# EAGLE design SensorBoard (EAGLE 6.5.0)
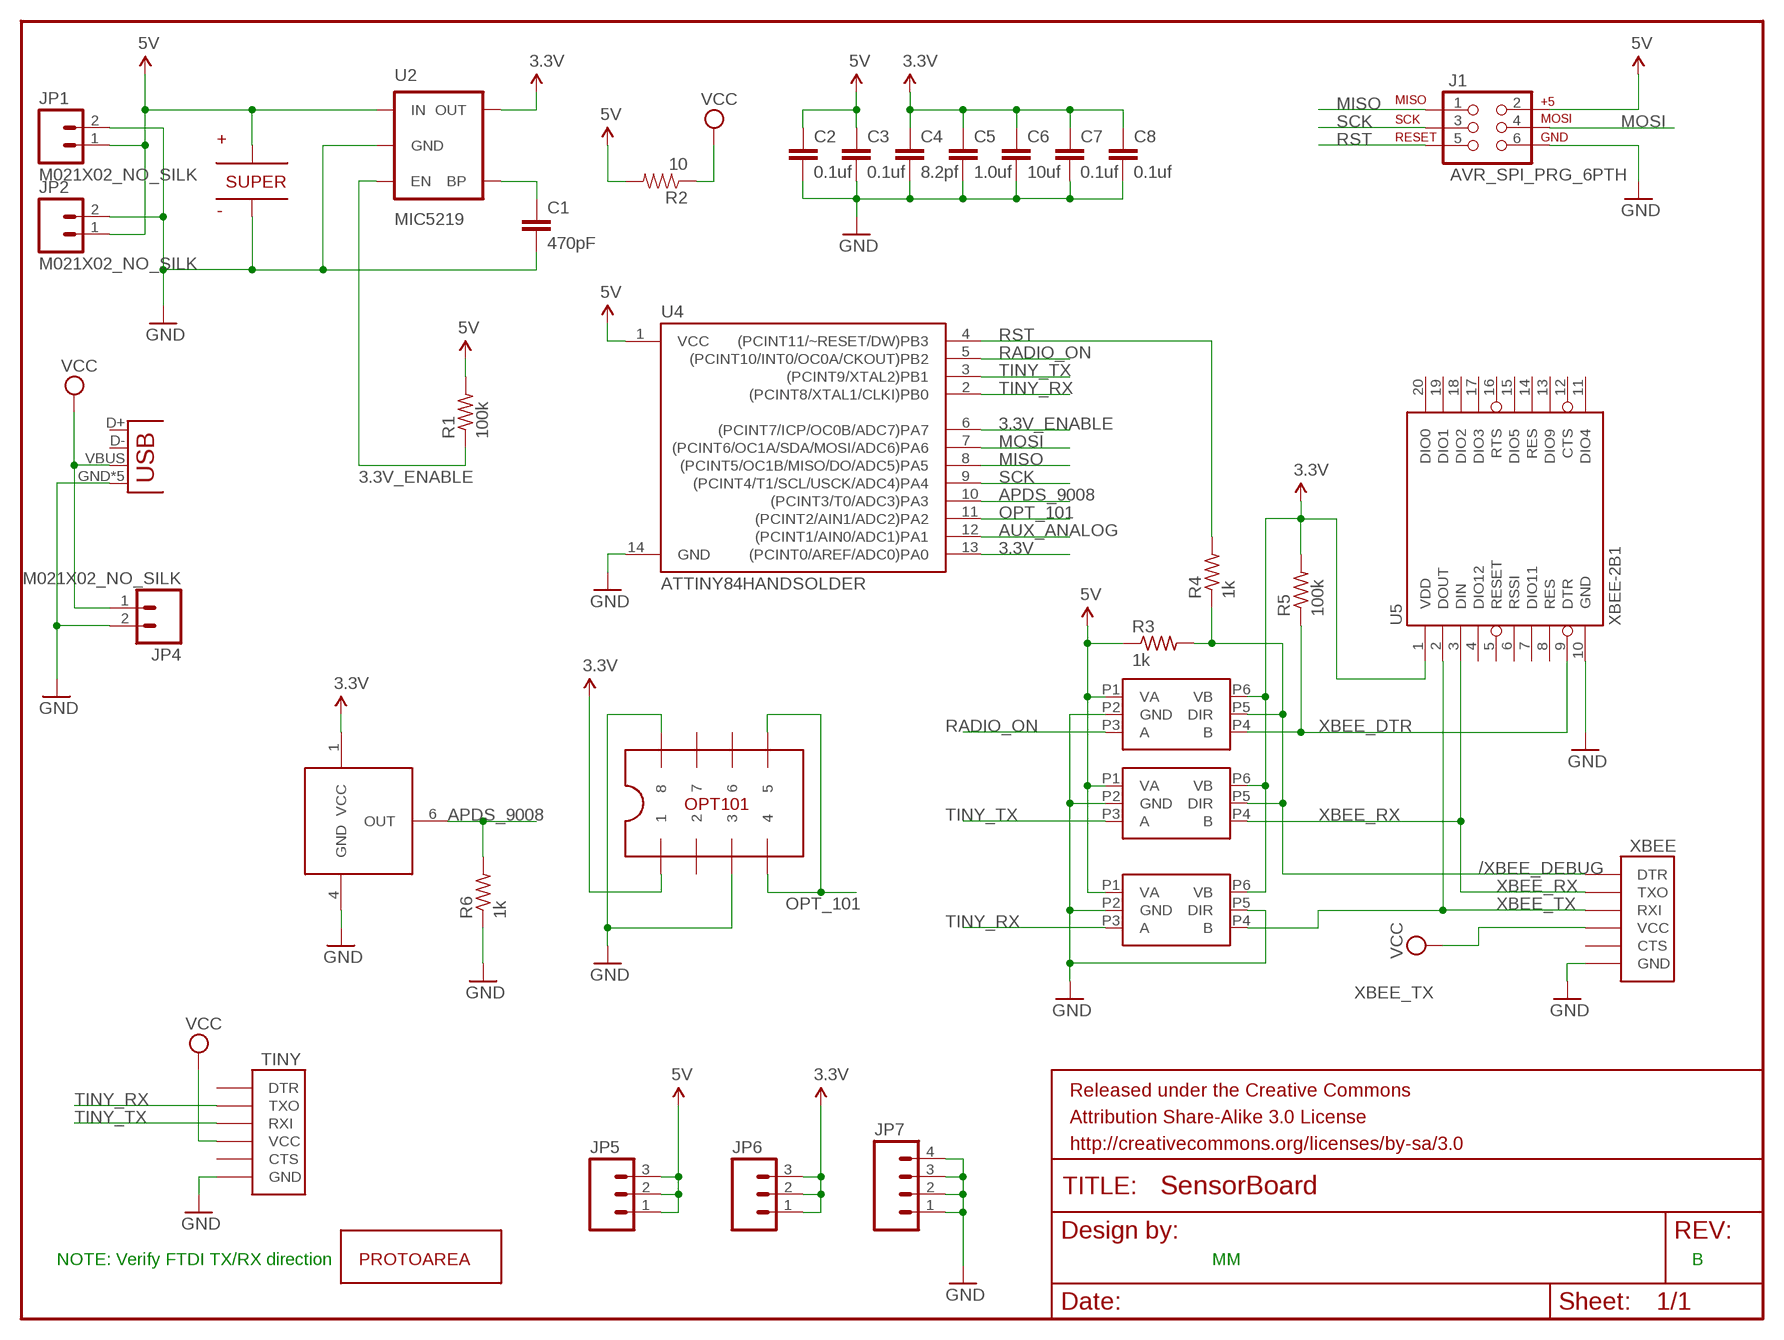
[diagram p0: schematic, sheet 1]

## Parts
C1  470pF  CAP1210  [1210]
C2  0.1uf  CAP1210  [1210]
C3  0.1uf  CAP1210  [1210]
C4  8.2pf  CAP1210  [1210]
C5  1.0uf  CAP1210  [1210]
C6  10uf  CAP1210  [1210]
C7  0.1uf  CAP1210  [1210]
C8  0.1uf  CAP1210  [1210]
FRAME1  FRAME-LETTER  [CREATIVE_COMMONS]
J1  AVR_SPI_PRG_6PTH  [2X3]
JP1  M021X02_NO_SILK  [1X02_NO_SILK]
JP2  M021X02_NO_SILK  [1X02_NO_SILK]
JP3  USBSMD  [USB-MINIB]
JP4  M021X02_NO_SILK  [1X02_NO_SILK]
JP5  M031X03_NO_SILK  [1X03_NO_SILK]
JP6  M031X03_NO_SILK  [1X03_NO_SILK]
JP7  M041X04_NO_SILK  [1X04_NO_SILK]
R1  100k  R-US_R1210  [R1210]
R2  10  RESISTORAXIAL-0.3  [AXIAL-0.3]
R3  1k  R-US_R1210  [R1210]
R4  1k  R-US_R1210  [R1210]
R5  100k  R-US_R1210  [R1210]
R6  1k  R-US_R1210  [R1210]
TINY  FTDI_DEVICE  [FTDI_DEVICE_SIDE]
U1  APDS-9008  [APDS-9008]
U2  MIC5219  V_REG_MIC52193.3V  [SOT23-5]
U3  OPT101TH  [DIL08]
U4  ATTINY84HANDSOLDER  [SO14-EZ]
U5  XBEE-2B1  [XBEE-1]
U$1  FYD0H225ZF  [SUPERCAP-28.5]
U$2  PROTOAREA-10X10  [PROTOAREA-10X10]
U$3  SN74LVC1T45  [DBV-R-PDSO-G6]
U$4  SN74LVC1T45  [DBV-R-PDSO-G6]
U$5  SN74LVC1T45  [DBV-R-PDSO-G6]
XBEE  FTDI_DEVICE  [FTDI_DEVICE_SIDE]

## Nets
3.3V [power]: C4.1 C5.1 C6.1 C7.1 C8.1 JP6.1 JP6.2 JP6.3 R5.2 U1.1(VCC) U2.5(OUT) U3.1 U4.13((PCINT0/AREF/ADC0)PA0) U5.1(VDD) U$3.P6(VB) U$4.P6(VB) U$5.P6(VB)
3.3V_ENABLE: R1.1 U2.3(EN) U4.6((PCINT7/ICP/OC0B/ADC7)PA7)
5V [power]: C2.1 C3.1 J1.2 JP1.1 JP2.1 JP5.1 JP5.2 JP5.3 R1.2 R2.P$2 R3.1 U2.1(IN) U4.1(VCC) U$1.+ U$3.P1(VA) U$4.P1(VA) U$5.P1(VA)
/XBEE_DEBUG: R3.2 R4.1 U$3.P5(DIR) U$4.P5(DIR) XBEE.P$1(DTR)
APDS_9008: R6.2 U1.6(OUT) U4.10((PCINT3/T0/ADC3)PA3)
AUX_ANALOG [power]: U4.12((PCINT1/AIN0/ADC1)PA1)
GND [power]: C1.2 C2.2 C3.2 C4.2 C5.2 C6.2 C7.2 C8.2 J1.6 JP1.2 JP2.2 JP3.GND JP3.MTN1(GND) JP3.MTN2(GND) JP3.MTN3(GND) JP3.MTN4(GND) JP4.2 JP7.1 JP7.2 JP7.3 JP7.4 R6.1 TINY.P$6(GND) U1.4(GND) U2.2(GND) U3.3 U3.8 U4.14(GND) U5.10(GND) U$1.- U$3.P2(GND) U$4.P2(GND) U$5.P2(GND) U$5.P5(DIR) XBEE.P$6(GND)
MISO: J1.1 U4.8((PCINT5/OC1B/MISO/DO/ADC5)PA5)
MOSI: J1.4 U4.7((PCINT6/OC1A/SDA/MOSI/ADC6)PA6)
N$3: C1.1 U2.4(BP)
OPT_101: U3.4 U3.5 U4.11((PCINT2/AIN1/ADC2)PA2)
RADIO_ON: U4.5((PCINT10/INT0/OC0A/CKOUT)PB2) U$3.P3(A)
RST: J1.5 R4.2 U4.4((PCINT11/~RESET/DW)PB3)
SCK: J1.3 U4.9((PCINT4/T1/SCL/USCK/ADC4)PA4)
TINY_RX: TINY.P$2(TXO) U4.2((PCINT8/XTAL1/CLKI)PB0) U$5.P3(A)
TINY_TX: TINY.P$3(RXI) U4.3((PCINT9/XTAL2)PB1) U$4.P3(A)
VCC: JP3.VBUS JP4.1 R2.P$1 TINY.P$4(VCC) XBEE.P$4(VCC)
XBEE_DTR: R5.1 U5.9(DTR) U$3.P4(B)
XBEE_RX: U5.3(DIN) U$4.P4(B) XBEE.P$2(TXO)
XBEE_TX: U5.2(DOUT) U$5.P4(B) XBEE.P$3(RXI)
Unconnected: JP3.D+ JP3.D- TINY.P$1(DTR) TINY.P$5(CTS) U3.2 U3.6 U3.7 U5.4(DIO12) U5.5(RESET) U5.6(RSSI) U5.7(DIO11) U5.8(RES) U5.11(DIO4) U5.12(CTS) U5.13(DIO9) U5.14(RES) U5.15(DIO5) U5.16(RTS) U5.17(DIO3) U5.18(DIO2) U5.19(DIO1) U5.20(DIO0) XBEE.P$5(CTS)

## Notes on the sheet
- NOTE: Verify FTDI TX/RX direction | MM | B

## Library data of the parts
C1-C8 = SparkFun-Capacitors:CAP: Capacitor Standard 0603 ceramic capacitor, and 0.1" leaded capacitor.
FRAME1 = MyLibrary:FRAME-LETTER: Schematic Frame Standard 8.5x11 US Letter frame
J1 = SparkFun-Connectors:AVR_SPI_PRG_6: AVR ISP 6 Pin This is the reduced ISP connector for AVR programming. Common on Arduino. This footprint will take up less PCB space and can be used with a 10-pin to 6-pin adapter such as SKU: BOB-08508
JP1 JP2 JP4 = SparkFun-Connectors:M02: Standard 2-pin 0.1" header. Use with - straight break away headers ( PRT-00116) - right angle break away headers (PRT-00553) - swiss pins (PRT-00743) - machine pins (PRT-00117) - female headers (PRT-00115) Molex polarized connector foot print use with: PRT-08233 with associated crimp pins and housings. 2.54_SCREWTERM for use with PRT-10571. 3.5mm Screw Terminal footprints for PRT-08084 5mm Screw Terminal footprints for use with PRT-08433
JP3 = SparkFun-Connectors:USB: USB Connectors USB-B-PTH is fully proven SKU : PRT-00139/CONN-08278 USB-miniB is fully proven SKU : PRT-00587 USB-A-PCB is untested. USB-A-H is throughly reviewed, but untested. Spark Fun Electronics SKU : PRT-00437 USB-B-SMT is throughly reviewed, but untested. Needs silkscreen touching up. USB-A-S has not been used/tested USB-MB-H has not been used/tested USB-MICROB has been used. CONN-09505; PROD_ID: CONN-08193
JP5 JP6 = SparkFun-Connectors:M03: Header 3 Standard 3-pin 0.1" header. Use with straight break away headers (SKU : PRT-00116), right angle break away headers (PRT-00553), swiss pins (PRT-00743), machine pins (PRT-00117), and female headers (PRT-00115). Molex polarized connector foot print use with SKU : PRT-08232 with associated crimp pins and housings.
JP7 = SparkFun-Connectors:M04: Header 4 Standard 4-pin 0.1" header. Use with straight break away headers (SKU : PRT-00116), right angle break away headers (PRT-00553), swiss pins (PRT-00743), machine pins (PRT-00117), and female headers (PRT-00115). Molex polarized connector foot print use with SKU : PRT-08231 with associated crimp pins and housings. 1MM SMD Version SKU: PRT-10208
R1 R3-R6 = rcl:R-US_: RESISTOR, American symbol
R2 = SparkFun-Passives:RESISTOR: Resistor Basic schematic elements and footprints for 0603, 1206, and PTH resistors.
TINY XBEE = SparkFun-Connectors:FTDI_DEVICE: Connector which mates to FTDI basic or FTDI cable.
U1 = MyLibrary:APDS-9008: Miniature Surface-Mount Ambient Light Photo Sensor
U2 = SparkFun-PowerIC:V_REG_MIC5219: V_REG MIC5219 Standard 3.3V and 5V 500mA LDO voltage regulator in SOT-23 layout. Micrel part MIC5219. BP (by-pass) pin is used to lower output noise with 470pF cap, may be left open.; PROD_ID: VREG-09872; VALUE: MIC5219 3.3V
U3 = MyLibrary:OPT101: MONOLITHIC PHOTODIODE AND SINGLE-SUPPLY TRANSIMPEDANCE AMPLIFIER
U4 = MyLibrary:ATTINY84: Atmel 14-pin 2/4/8kB flash uC
U5 = SparkFun-RF:XBEE-2: Xbee module footprints SMT header is CONN-09042.
U$1 = MyLibrary:FYD0H225ZF
U$2 = MyLibrary:PROTOAREA-10X10
U$3-U$5 = MyLibrary:SN74LVC1T45

## Net classes
0 default: width 0.152 mm, drill 0.33 mm, clearance 0.152 mm
1 power: width 0.152 mm, drill 0.33 mm, clearance 0.152 mm

## Board
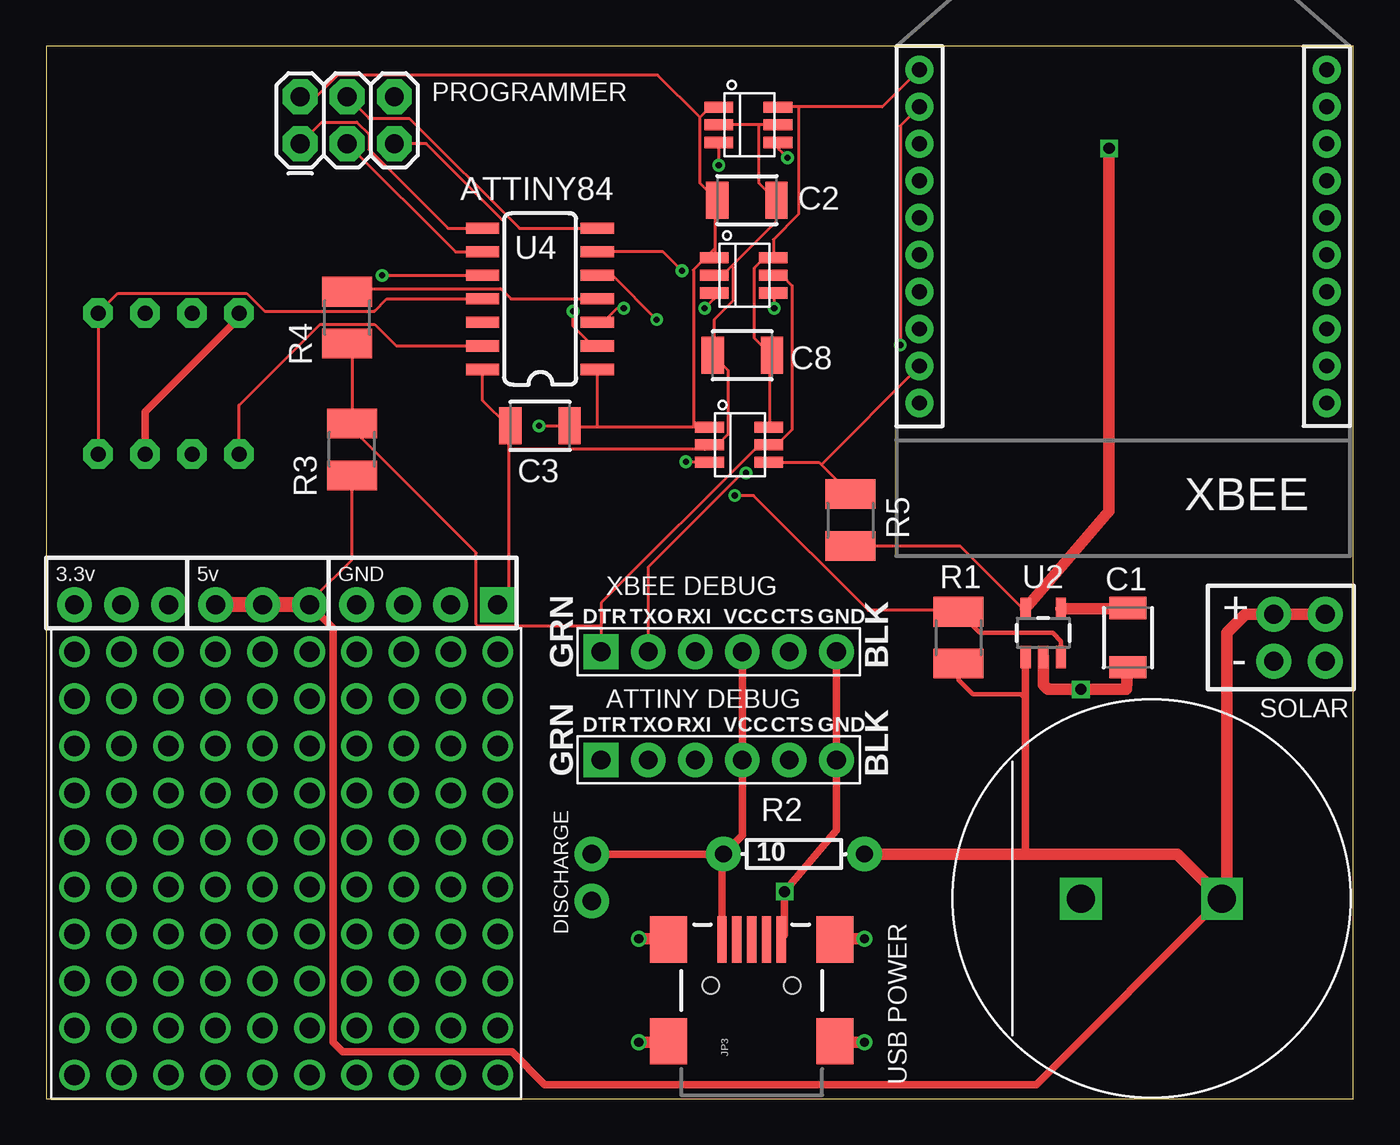
[diagram p1: board, top side]
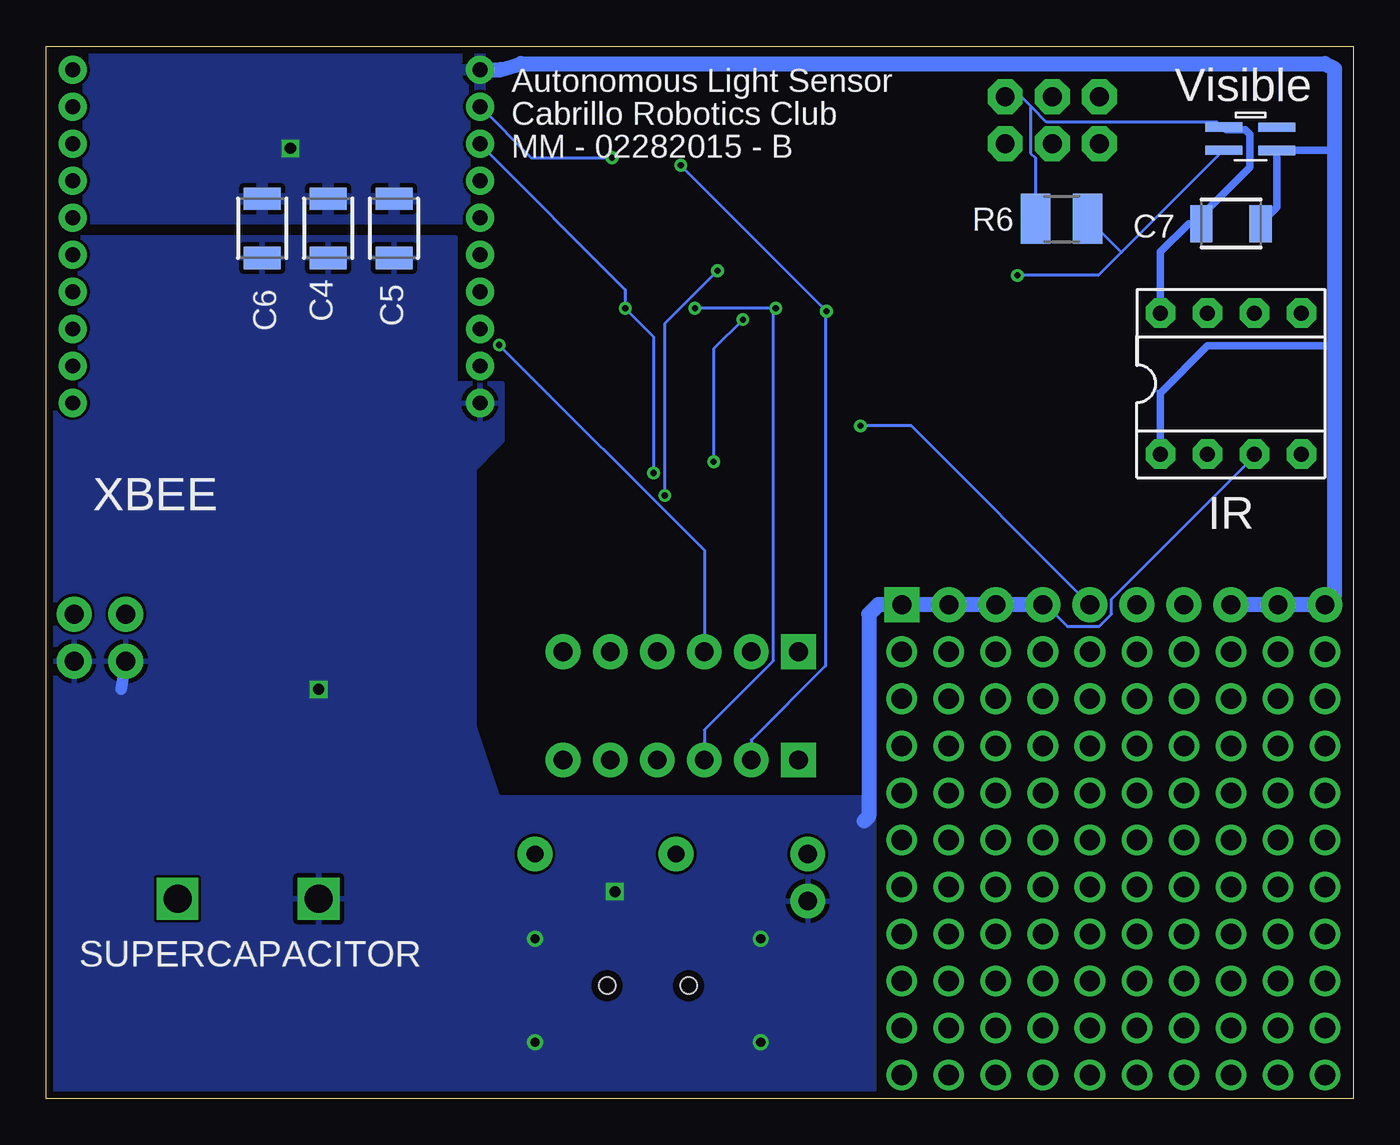
[diagram p2: board, bottom side, seen from below]

Size 70.59 x 56.82 mm. Coordinates in mm from the lower left corner, seen from the top.
Outline: 0,0 70.59,0 70.59,56.82 0,56.82 0,0
Copper layers (1*16): Top 0.0356mm / dielectric 1.5011mm / Bottom 0.0356mm
Design rules "LaenPCBOrder": minimum track width 6mil, minimum drill 13mil, track to track 6mil, track to pad 6mil, pad to pad 6mil, via to via 6mil, smd to smd 6mil, copper to edge 15mil, drill to drill 6mil, minimum pad ring 7mil, minimum via ring 7mil, stop-mask expansion 3mil, vias tented up to drill 0mil, thermal gap 10mil

### Footprints (pad centres in the part's own frame; a part is rotated, then mirrored left to right if it is on the bottom)
1210 = smd 1.2 x 2: 1 -1.6,0; 2 1.6,0
2X3 = drill 1.016 pad 1.88 octagon: 1 0,0; 2 0,2.54; 3 2.54,0; 4 2.54,2.54; 5 5.08,0; 6 5.08,2.54
1X02_NO_SILK = drill 1.016 pad 1.88: 1 0,0; 2 2.54,0
USB-MINIB = smd 2.5 x 0.5: D+ 2.5,0; D- 2.5,0.8; GND 2.5,-1.6; ID 2.5,-0.8; VBUS 2.5,1.6 | smd 2.5 x 2: MTN1 -3,4.5; MTN2 2.5,4.5; MTN3 -3,-4.5; MTN4 2.5,-4.5 | hole 0.9: 0,2.2; 0,-2.2
1X03_NO_SILK = drill 1.016 pad 1.88: 1 0,0; 2 2.54,0; 3 5.08,0
1X04_NO_SILK = drill 1.016 pad 1.88 square: 1 0,0 | drill 1.016 pad 1.88: 2 2.54,0; 3 5.08,0; 4 7.62,0
R1210 = smd 1.6 x 2.7: 1 -1.4,0; 2 1.4,0
AXIAL-0.3 = drill 0.9 pad 1.88: P$1 -3.81,0; P$2 3.81,0
FTDI_DEVICE_SIDE = drill 1.016 pad 1.88 square: P$1 -6.35,0 | drill 1.016 pad 1.88: P$2 -3.81,0; P$3 -1.27,0; P$4 1.27,0; P$5 3.81,0; P$6 6.35,0
APDS-9008 = smd 0.5 x 2: 1 1.38,2.22; 3 0.13,2.22; 4 0.12,-0.63; 6 1.37,-0.63
SOT23-5 = smd 0.55 x 1.2: 1 -0.95,-1.3; 2 0,-1.3; 3 0.95,-1.3; 4 0.95,1.3; 5 -0.95,1.3
DIL08 = drill 0.813 pad 1.6 octagon: 1 -3.81,-3.81; 2 -1.27,-3.81; 3 1.27,-3.81; 4 3.81,-3.81; 5 3.81,3.81; 6 1.27,3.81; 7 -1.27,3.81; 8 -3.81,3.81
SO14-EZ = smd 0.6 x 1.8: 1 -5.08,-3.1; 2 -3.81,-3.1; 3 -2.54,-3.1; 4 -1.27,-3.1; 5 0,-3.1; 6 1.27,-3.1; 7 2.54,-3.1; 8 2.54,3.1; 9 1.27,3.1; 10 0,3.1; 11 -1.27,3.1; 12 -2.54,3.1; 13 -3.81,3.1; 14 -5.08,3.1
XBEE-1 = drill 0.8 pad 1.524: 1 -11,20; 2 -11,18; 3 -11,16; 4 -11,14; 5 -11,12; 6 -11,10; 7 -11,8; 8 -11,6; 9 -11,4; 10 -11,2; 11 11,2; 12 11,4; 13 11,6; 14 11,8; 15 11,10; 16 11,12; 17 11,14; 18 11,16; 19 11,18; 20 11,20
SUPERCAP-28.5 = drill 1.5 square: + -3.81,0; - 3.81,0
PROTOAREA-10X10 = drill 1.1: AXS 0,22.86; P$1 0,0; P$2 2.54,0; P$3 5.08,0; P$4 7.62,0; P$5 10.16,0; P$6 12.7,0; P$7 15.24,0; P$8 17.78,0; P$9 20.32,0; P$10 22.86,0; P$11 22.86,2.54; P$12 20.32,2.54; P$13 17.78,2.54; P$14 15.24,2.54; P$15 12.7,2.54; P$16 10.16,2.54; P$17 5.08,2.54; P$18 7.62,2.54; P$19 2.54,2.54; P$20 0,2.54; P$21 0,5.08; P$22 2.54,5.08; P$23 5.08,5.08; P$24 7.62,5.08; P$25 10.16,5.08; P$26 12.7,5.08; P$27 15.24,5.08; P$28 17.78,5.08; P$29 22.86,5.08; P$30 20.32,5.08; P$31 22.86,7.62; P$32 20.32,7.62; P$33 17.78,7.62; P$34 15.24,7.62; P$35 12.7,7.62; P$36 10.16,7.62; P$37 7.62,7.62; P$38 5.08,7.62; P$39 2.54,7.62; P$40 0,7.62; P$41 0,10.16; P$42 2.54,10.16; P$43 5.08,10.16; P$44 7.62,10.16; P$45 10.16,10.16; P$46 12.7,10.16; P$47 15.24,10.16; P$48 17.78,10.16; P$49 20.32,10.16; P$50 22.86,10.16; P$51 22.86,12.7; P$52 20.32,12.7; P$53 17.78,12.7; P$54 15.24,12.7; P$55 12.7,12.7; P$56 10.16,12.7; P$57 7.62,12.7; P$58 5.08,12.7; P$59 2.54,12.7; P$60 0,12.7; P$61 0,15.24; P$62 2.54,15.24; P$63 5.08,15.24; P$64 7.62,15.24; P$65 10.16,15.24; P$66 12.7,15.24; P$67 15.24,15.24; P$68 17.78,15.24; P$69 20.32,15.24; P$70 22.86,15.24; P$71 22.86,17.78; P$72 20.32,17.78; P$73 17.78,17.78; P$74 15.24,17.78; P$75 12.7,17.78; P$76 10.16,17.78; P$77 7.62,17.78; P$78 5.08,17.78; P$79 2.54,17.78; P$80 0,17.78; P$81 0,20.32; P$83 2.54,22.86; P$84 2.54,20.32; P$85 5.08,20.32; P$86 5.08,22.86; P$87 7.62,22.86; P$88 7.62,20.32; P$89 10.16,20.32; P$90 10.16,22.86; P$91 12.7,22.86; P$92 12.7,20.32; P$93 15.24,20.32; P$94 15.24,22.86; P$95 17.78,22.86; P$96 17.78,20.32; P$97 20.32,20.32; P$98 20.32,22.86; P$99 22.86,22.86; P$100 22.86,20.32
DBV-R-PDSO-G6 = smd 0.6 x 1.55: P1 -0.95,-0.25; P2 0,-0.25; P3 0.95,-0.25; P4 0.95,2.95; P5 0,2.95; P6 -0.95,2.95

### Placement (x,y rotation side)
C1  58.42,24.89 270 top
C2  37.85,48.51 0 top
C3  26.67,36.32 180 top
C4  55.37,46.99 270 bottom
C5  51.82,46.99 270 bottom
C6  58.93,46.99 270 bottom
C7  6.6,47.24 180 bottom
C8  37.59,40.13 180 top
FRAME1  -19.56,-10.16 0 top  (outside the outline)
J1  13.72,51.56 0 top
JP1  66.29,26.16 270 top
JP2  69.09,26.16 270 top
JP3  38.1,6.1 90 top
JP4  29.46,13.21 270 top
JP5  9.14,26.67 0 top
JP6  6.6,26.67 180 top
JP7  24.38,26.67 180 top
R1  49.28,24.89 270 top
R2  40.39,13.21 0 top
R3  16.51,35.05 90 top
R4  16.26,42.16 90 top
R5  43.43,31.24 270 top
R6  15.75,47.5 0 bottom
TINY  36.32,18.29 0 top
U1  6.35,52.58 270 bottom
U2  53.85,25.15 0 top
U3  6.6,38.61 0 bottom
U4  26.67,44.45 90 top
U5  58.17,35.56 0 top
U$1  59.69,10.79 180 top
U$2  1.52,1.27 0 top
U$3  36.07,35.31 270 top
U$4  36.32,44.45 270 top
U$5  36.58,52.58 270 top
XBEE  36.32,24.13 0 top

### Tracks (layer width: path | path; a pad name or v marks a point on that pad's centre or on a via)
3.3V  (via drill 0.6)
  Top 0.152: R5.2 42.22,29.82 49.38,29.82 52.63,26.57 U2.5 | U$3.P6 39.06,36.27 39.06,40.03 39.17,40.13 C8.1 39.12,40.18 38.25,41.05 38.25,44.86 38.76,45.36 39.27,45.36 U$4.P6 39.27,45.47 39.27,46.38 40.64,47.75 40.64,53.54 | 40.64,53.54 45.16,53.54 47.14,55.52 U5.1 | 40.64,53.54 39.57,53.54 U$5.P6 | U4.13 18.9,40.64 17.73,41.81 14.78,41.81 10.41,37.44 U3.1
  Top 0.61: U2.5 57.4,31.71 v57.4,51.31
  Bottom 0.152: 10.57,38.2 10.41,38.1
  Bottom 0.406: 1.02,51.31 0.87,51.2 U1.1 4.13,48.12 C7.1 | U3.1 10.41,38.1 7.87,40.64 1.02,40.64
  Bottom 0.813: U5.1 46.04,55.56 44.96,55.88 1.52,55.88 1.02,55.63 1.02,51.31 1.02,40.64 1.02,27.18 JP6.3 JP6.2 JP6.1
  pour Bottom: 46.23,56.39 69.34,56.39 69.34,47.5 46.23,47.5
3.3V_ENABLE  (via drill 0.33)
  Top 0.152: U4.6 33.33,45.72 v34.34,44.7 | v37.19,32.56 38.2,32.56 44.4,26.36 49.17,26.36 R1.1
  Top 0.254: U2.3 54.8,24.7 54.36,25.15 50.42,25.15 R1.1
  Bottom 0.152: v34.34,44.7 37.19,41.86 v37.19,32.56
5V  (via drill 0.33)
  Top 0.152: R3.1 16.51,29.11 14.43,27.03 JP5.3 | v26.62,36.32 C3.1 28.3,36.27 29.77,36.27 | 29.77,36.27 34.95,36.27 | 34.95,36.27 35.81,36.27 U$3.P1 | 29.77,36.27 U4.1 | 36.12,45.87 36.12,48.41 36.22,48.51 C2.1 36.17,48.56 35.31,49.43 35.31,52.98 | 36.12,45.87 36.12,45.41 U$4.P1 | 35.31,52.98 35.81,53.49 36.32,53.49 U$5.P1 | J1.2 14.58,54.1 15.75,55.27 33.02,55.27 35.31,52.98 | 34.95,36.27 34.95,44.76 36.07,45.87 36.12,45.87
  Top 0.254: R1.2 49.28,22.61 50.04,21.84 52.64,21.84 52.9,21.59
  Top 0.406: U2.1 52.9,21.59 52.9,13.4 53.09,13.21 | JP5.3 15.49,25.4 15.49,3.05 16,2.54 25.15,2.54 26.92,0.76 53.47,0.76 U$1.+
  Top 0.61: R2.P$2 53.09,13.21 61.09,13.21 U$1.+ 63.75,11.05 63.75,25.15 64.77,26.16 JP1.1 JP2.1
  Top 0.813: JP5.3 JP5.2 JP5.1
  Bottom 0.152: v26.62,36.32 23.88,36.32 JP5.3
/XBEE_DEBUG
  Top 0.152: R4.1 16.26,40.74 16.51,40.49 R3.2 16.56,36.42 16.56,36.12 23.22,29.46 23.22,25.6 23.32,25.5 29.97,25.5 | U$4.P5 39.73,44.45 40.28,43.89 40.28,36.12 39.47,35.31 U$3.P5 38.96,35.26 38.46,35.26 29.97,26.77 29.97,25.5 | 29.97,25.5 XBEE.P$1
APDS_9008  (via drill 0.33)
  Top 0.152: v18.14,44.45 U4.10
  Bottom 0.152: v18.14,44.45 13.77,44.45 12.52,45.7 | 12.52,45.7 7.01,51.21 U1.6 | 12.52,45.7 14.33,47.5 R6.2
GND  (via drill 0.5, 0.6)
  Top 0.152: 24.99,27.28 JP7.1 24.99,27.33 24.99,35.05 | 24.99,36.27 C3.2 | U4.14 23.57,37.69 24.94,36.32 C3.2 | 24.99,35.05 24.99,36.22 C3.2 | U$5.P5 38.51,52.58 | 38.51,52.58 U$5.P2 | U$4.P2 36.52,44.45 37.03,44.96 | 37.03,44.96 39.42,47.35 39.42,48.51 C2.2 39.37,48.56 38.51,49.43 38.51,52.58 | 37.03,44.96 37.08,44.91 37.08,43.08 36.07,42.06 36.07,40.18 C8.2 36.02,40.13 36.83,39.32 36.83,35.87 36.27,35.31 U$3.P2 35.76,35.26 35.56,35.05 24.99,35.05
  Top 0.305: 39.95,11.1 v39.88,11.18
  Top 0.406: U3.8 10.41,42.16 5.33,37.08 U3.3 | XBEE.P$6 TINY.P$6 42.67,14.48 v39.88,11.18 39.88,8.85 JP3.GND
  Top 0.61: U2.2 53.85,22.35 54.1,22.1 v55.88,22.1 58.34,22.1 C1.2 | v32,8.64 33.6,8.64 JP3.MTN2 | v32,3.05 33.6,3.05 JP3.MTN1 | v44.2,8.64 42.6,8.64 JP3.MTN4 | v44.2,3.05 42.6,3.05 JP3.MTN3
  Bottom 0.152: J1.6 17.93,54.1 17.37,53.54 | 17.37,53.54 16.56,52.73 7.37,52.73 7.16,52.53 U1.4 | U3.3 5.33,34.7 13.06,26.98 13.06,26.16 13.72,25.5 15.44,25.5 16.41,26.47 JP7.4 | R6.1 17.17,47.5 17.17,50.8 17.42,51.05 17.42,53.49 17.37,53.54
  Bottom 0.406: U3.8 10.41,45.72 8.89,47.24 C7.2 8.2,47.68 5.59,50.29 5.59,52.07 5.84,52.32 6.85,52.32 U1.4
  Bottom 0.61: 66.55,22.1 JP1.2
  Bottom 0.813: JP7.4 JP7.3 JP7.2 JP7.1 25.65,26.67 26.16,26.16 26.16,15.24 26.42,14.99
  pour Bottom: 25.91,0 25.91,15.49 26.16,16.26 46.23,16.26 47.5,20.07 47.5,34.04 45.97,35.56 45.97,38.61 48.51,38.61 48.51,46.48 69.34,46.48 70.61,44.96 70.87,0
MISO
  Top 0.152: U4.8 21.69,46.99 17.42,51.26 17.42,52.07 16.76,52.73 14.88,52.73 J1.1
MOSI
  Top 0.152: U4.7 25.55,46.99 19.61,52.93 17.42,52.93 J1.4
N$3
  Top 0.61: U2.4 58.12,26.45 C1.1
OPT_101
  Top 0.152: U3.4 U3.5 3.86,43.48 10.82,43.48 11.79,42.52 17.73,42.52 18.39,43.18 U4.11
RADIO_ON  (via drill 0.33)
  Top 0.152: v34.54,34.39 35.81,34.39 U$3.P3 | v32.97,42.06 30.58,44.45 U4.5
  Bottom 0.152: v34.54,34.39 34.54,40.49 v32.97,42.06
RST
  Top 0.152: U4.4 25.09,43.18 24.69,43.59 | 24.69,43.59 24.54,43.74 16.41,43.74 16.26,43.59 R4.2 | J1.5 20.52,51.56 24.74,47.35 24.74,43.64 24.69,43.59
SCK
  Top 0.152: U4.9 22.1,45.72 J1.3
TINY_RX  (via drill 0.33)
  Top 0.152: v36.32,50.39 36.32,51.61 U$5.P3 | v28.45,42.52 28.45,41.71 29.52,40.64 U4.2
  Bottom 0.152: v36.32,50.39 v28.45,42.52 28.5,42.47 28.5,23.37 32.51,19.36 TINY.P$2
TINY_TX  (via drill 0.33)
  Top 0.152: v35.56,42.67 36.07,43.18 36.07,43.48 U$4.P3 | v31.19,42.67 30.84,42.67 30.07,41.91 U4.3
  Bottom 0.152: v35.56,42.67 v31.19,42.67 31.34,42.62 31.34,23.62 35.05,19.91 TINY.P$3
VCC
  Top 0.406: R2.P$1 36.75,13.03 36.5,13.03 JP3.VBUS | JP4.1 R2.P$1 | R2.P$1 37.59,14.22 TINY.P$4 XBEE.P$4
XBEE_DTR
  Top 0.152: 41.86,34.24 43.43,32.66 R5.1 | 41.86,34.24 41.76,34.34 39.06,34.34 U$3.P4 | 41.86,34.24 47.14,39.52 U5.9
XBEE_RX  (via drill 0.33)
  Top 0.152: v39.32,42.67 39.32,43.48 U$4.P4 | XBEE.P$2 32.51,28.7 37.59,33.78 v37.8,33.78
  Bottom 0.152: U5.3 47.14,51.51 39.32,43.69 v39.32,42.67 37.8,41.15 v37.8,33.78
XBEE_TX  (via drill 0.33)
  Top 0.152: v40.03,50.8 39.57,51.26 39.57,51.61 U$5.P4 | v46.13,40.69 46.13,52.53 47.14,53.54 U5.2
  Bottom 0.152: v40.03,50.8 44.4,50.8 47.14,53.54 U5.2 | XBEE.P$3 35.05,29.62 v46.13,40.69

### Text on the board
tPlace: 3.3v | 5v | GND
tNames: PROGRAMMER | ATTINY84 | XBEE | XBEE DEBUG | + | - | ATTINY DEBUG | SOLAR | DISCHARGE | USB POWER
bNames: Visible | Autonomous Light Sensor | Cabrillo Robotics Club | MM - 02282015 - B | XBEE | XBEE | IR | SUPERCAPACITOR